# Altium schematic sheet Top.SchDoc
size 437 x 311 mm
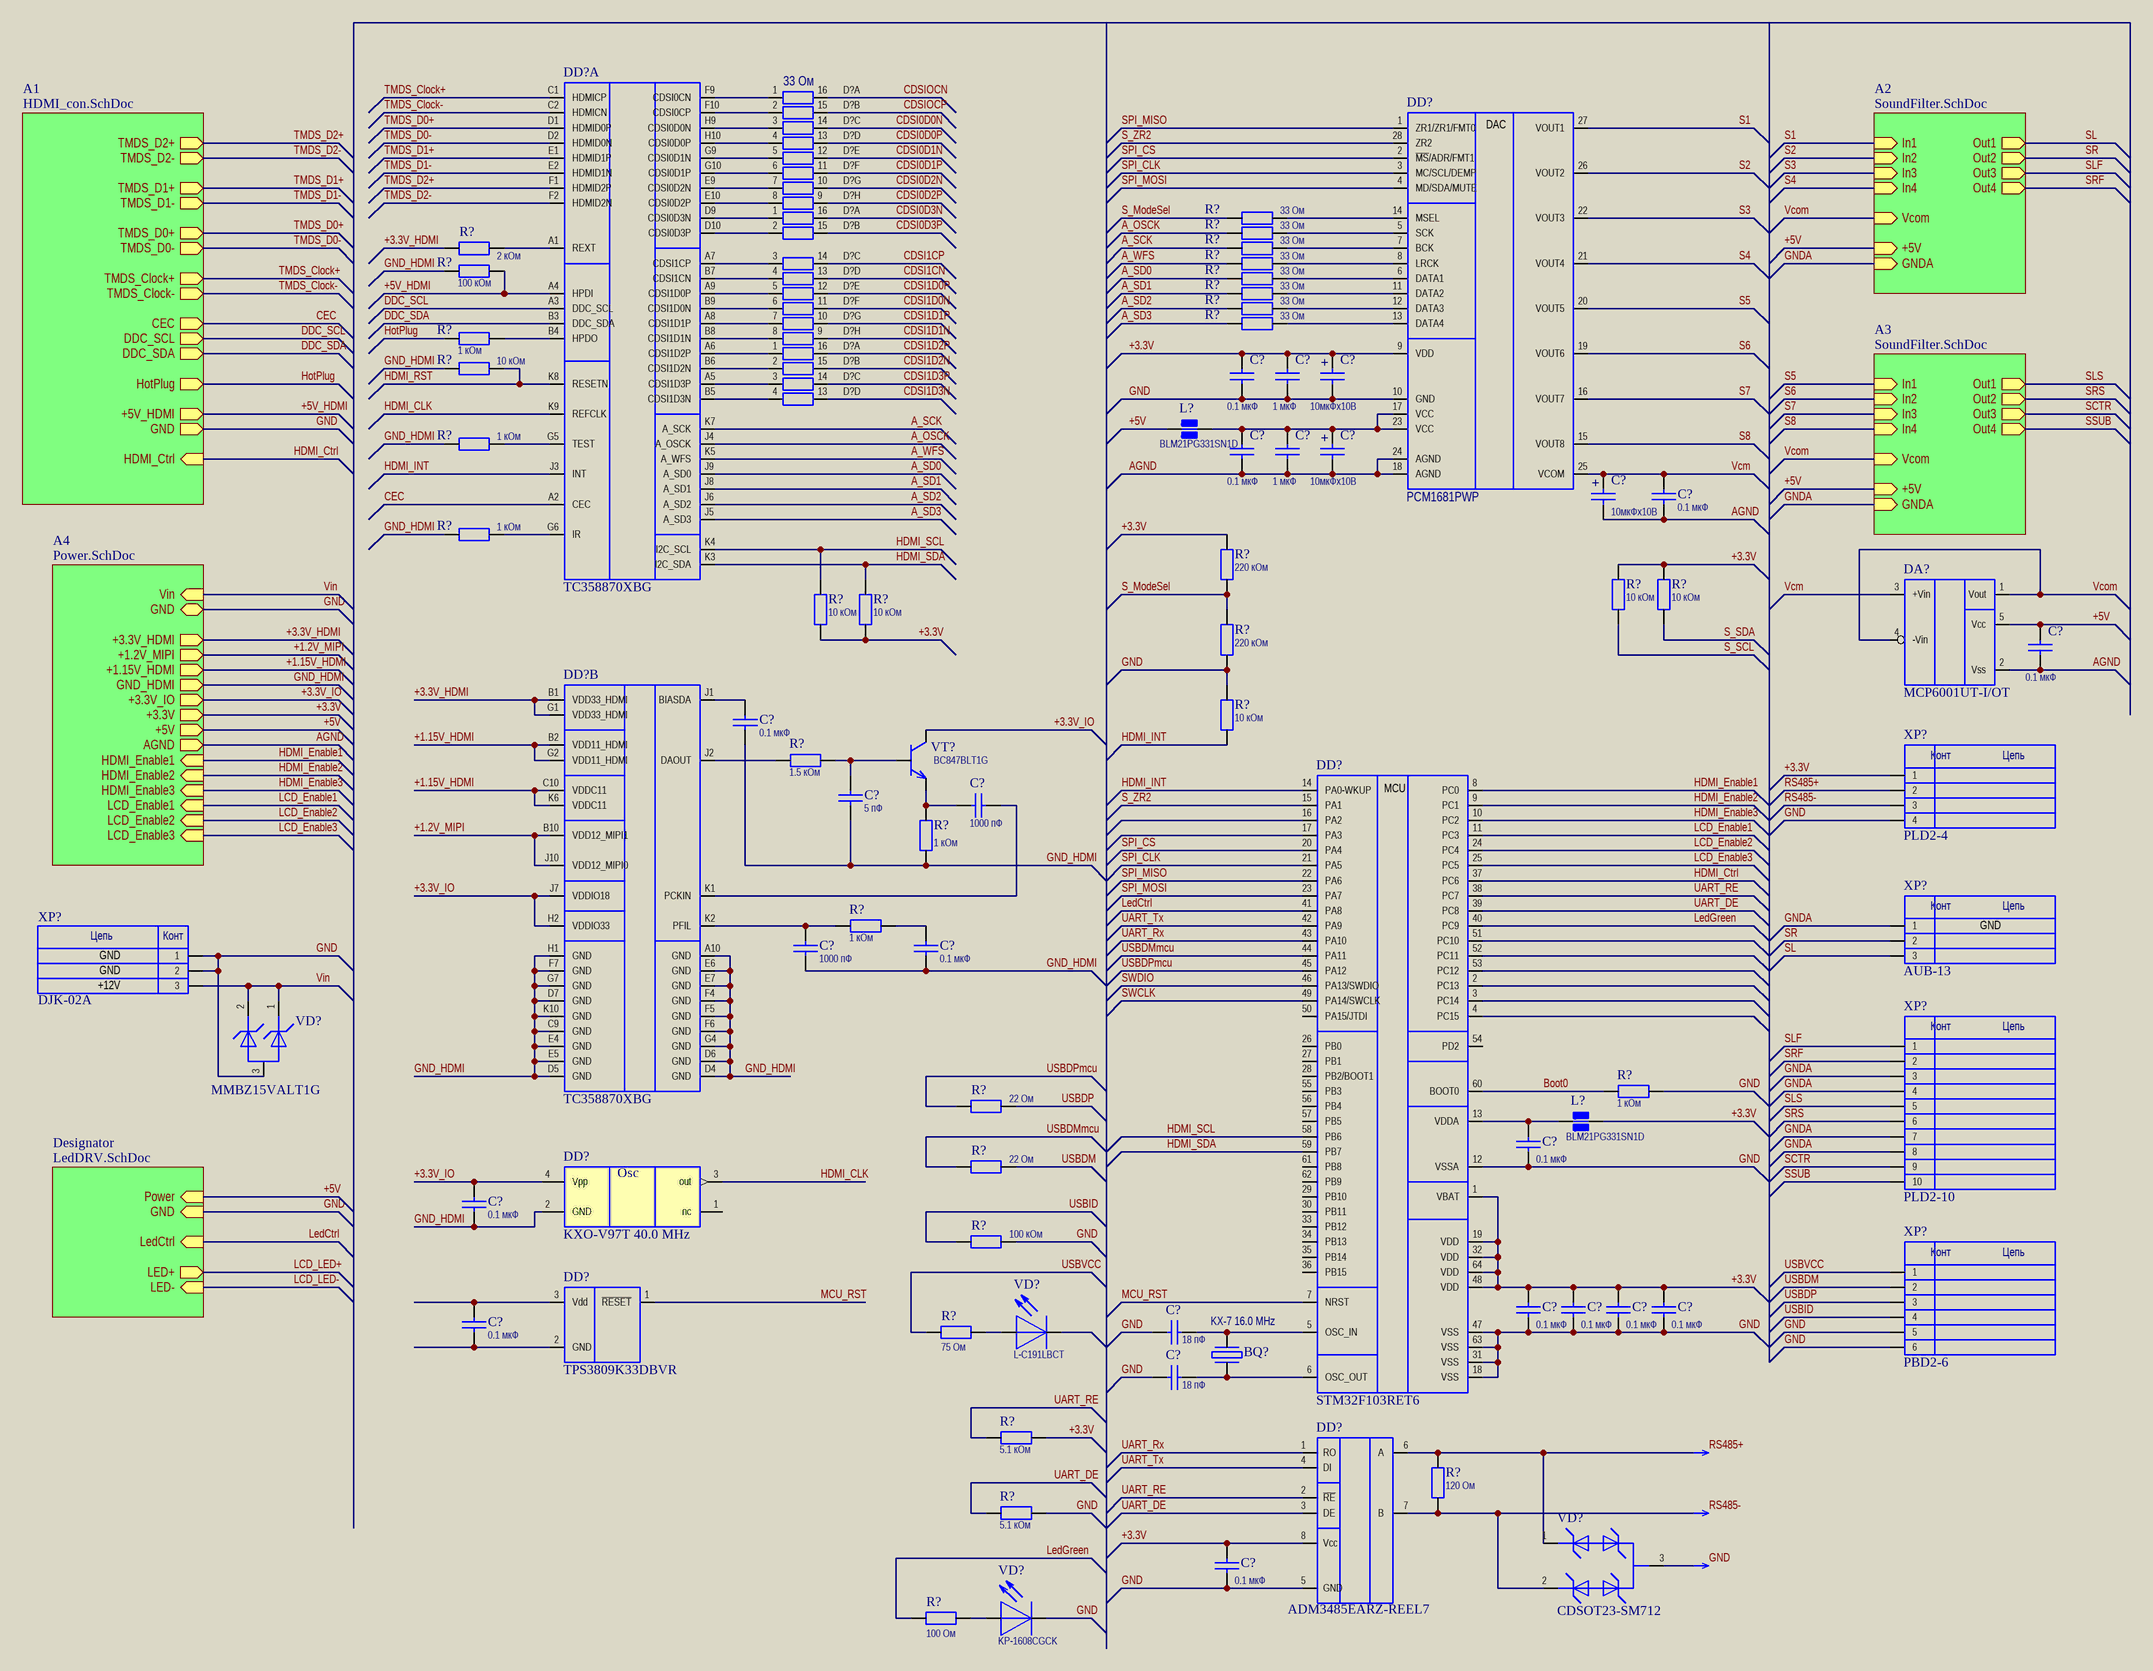
[diagram p0: Top.SchDoc]

## Parts
(Parts that share a designator on the sheet are numbered #1, #2 ... from top to bottom, then left to right.)
BQ?  KX-7 16.0 MHz  [KX-7]
C?#1  value 0.1 мкФ  [Chip0603]  (hidden comment: C)
C?#2  value 1 мкФ  [Chip0603]  (hidden comment: C)
C?#3  value 10мкФx10В  [ChipA]  (hidden comment: CP)
C?#4  value 0.1 мкФ  [Chip0603]  (hidden comment: C)
C?#5  value 1 мкФ  [Chip0603]  (hidden comment: C)
C?#6  value 10мкФx10В  [ChipA]  (hidden comment: CP)
C?#7  value 10мкФx10В  [ChipA]  (hidden comment: CP)
C?#8  value 0.1 мкФ  [Chip0603]  (hidden comment: C)
C?#9  value 0.1 мкФ  [Chip0603]  (hidden comment: C)
C?#10  value 0.1 мкФ  [Chip0603]  (hidden comment: C)
C?#11  value 5 пФ  [Chip0603]  (hidden comment: C)
C?#12  value 1000 пФ  [Chip0603]  (hidden comment: C)
C?#13  value 0.1 мкФ  [Chip0603]  (hidden comment: C)
C?#14  value 1000 пФ  [Chip0603]  (hidden comment: C)
C?#15  value 0.1 мкФ  [Chip0603]  (hidden comment: C)
C?#16  value 0.1 мкФ  [Chip0603]  (hidden comment: C)
C?#17  value 0.1 мкФ  [Chip0603]  (hidden comment: C)
C?#18  value 0.1 мкФ  [Chip0603]  (hidden comment: C)
C?#19  value 0.1 мкФ  [Chip0603]  (hidden comment: C)
C?#20  value 0.1 мкФ  [Chip0603]  (hidden comment: C)
C?#21  value 0.1 мкФ  [Chip0603]  (hidden comment: C)
C?#22  value 18 пФ  [Chip0603]  (hidden comment: C)
C?#23  value 18 пФ  [Chip0603]  (hidden comment: C)
C?#24  value 0.1 мкФ  [Chip0603]  (hidden comment: C)
D?#1  value 33 Ом  [YC248]  (hidden comment: YC248-JR-0733RL)  (part A of 8)
D?#2  YC248-JR-0733RL  [YC248]  (value not drawn)  (part B of 8)
D?#3  YC248-JR-0733RL  [YC248]  (value not drawn)  (part C of 8)
D?#4  YC248-JR-0733RL  [YC248]  (value not drawn)  (part D of 8)
D?#5  YC248-JR-0733RL  [YC248]  (value not drawn)  (part E of 8)
D?#6  YC248-JR-0733RL  [YC248]  (value not drawn)  (part F of 8)
D?#7  YC248-JR-0733RL  [YC248]  (value not drawn)  (part G of 8)
D?#8  YC248-JR-0733RL  [YC248]  (value not drawn)  (part H of 8)
D?#9  YC248-JR-0733RL  [YC248]  (value not drawn)  (part A of 8)
D?#10  YC248-JR-0733RL  [YC248]  (value not drawn)  (part B of 8)
D?#11  YC248-JR-0733RL  [YC248]  (value not drawn)  (part C of 8)
D?#12  YC248-JR-0733RL  [YC248]  (value not drawn)  (part D of 8)
D?#13  YC248-JR-0733RL  [YC248]  (value not drawn)  (part E of 8)
D?#14  YC248-JR-0733RL  [YC248]  (value not drawn)  (part F of 8)
D?#15  YC248-JR-0733RL  [YC248]  (value not drawn)  (part G of 8)
D?#16  YC248-JR-0733RL  [YC248]  (value not drawn)  (part H of 8)
D?#17  YC248-JR-0733RL  [YC248]  (value not drawn)  (part A of 8)
D?#18  YC248-JR-0733RL  [YC248]  (value not drawn)  (part B of 8)
D?#19  YC248-JR-0733RL  [YC248]  (value not drawn)  (part C of 8)
D?#20  YC248-JR-0733RL  [YC248]  (value not drawn)  (part D of 8)
DA?  MCP6001UT-I/OT  [SOT23-5]
DD?#1  PCM1681PWP  [HTSSOP-28]
DD?#2  TC358870XBG  [BGA80C65P10X10_700X700X100]  (part A of 2)
DD?#3  STM32F103RET6  [LQFP64_N]
DD?#4  TC358870XBG  [BGA80C65P10X10_700X700X100]  (part B of 2)
DD?#5  KXO-V97T 40.0 MHz  [KXO-V97T]
DD?#6  TPS3809K33DBVR  [SOT23]
DD?#7  ADM3485EARZ-REEL7  [SO8_s]
L?#1  Name: BLM21PG331SN1D  [Chip0805]  (hidden comment: Bead)
L?#2  Name: BLM21PG331SN1D  [Chip0805]  (hidden comment: Bead)
R?#1  33 Ом  [Res0603]
R?#2  33 Ом  [Res0603]
R?#3  2 кОм  [Res0603]
R?#4  33 Ом  [Res0603]
R?#5  33 Ом  [Res0603]
R?#6  100 кОм  [Res0603]
R?#7  33 Ом  [Res0603]
R?#8  33 Ом  [Res0603]
R?#9  33 Ом  [Res0603]
R?#10  33 Ом  [Res0603]
R?#11  1 кОм  [Res0603]
R?#12  10 кОм  [Res0603]
R?#13  1 кОм  [Res0603]
R?#14  1 кОм  [Res0603]
R?#15  220 кОм  [Res0603]
R?#16  10 кОм  [Res0603]
R?#17  10 кОм  [Res0603]
R?#18  10 кОм  [Res0603]
R?#19  10 кОм  [Res0603]
R?#20  220 кОм  [Res0603]
R?#21  10 кОм  [Res0603]
R?#22  1.5 кОм  [Res0603]
R?#23  1 кОм  [Res0603]
R?#24  1 кОм  [Res0603]
R?#25  1 кОм  [Res0603]
R?#26  22 Ом  [Res0603]
R?#27  22 Ом  [Res0603]
R?#28  100 кОм  [Res0603]
R?#29  75 Ом  [Res0603]
R?#30  5.1 кОм  [Res0603]
R?#31  120 Ом  [Res0603]
R?#32  5.1 кОм  [Res0603]
R?#33  100 Ом  [Res0603]
VD?#1  MMBZ15VALT1G  [SOT23]
VD?#2  L-C191LBCT  [LED_ltst_blue]
VD?#3  CDSOT23-SM712  [SOT23]
VD?#4  KP-1608CGCK  [LED_ltst_green]
VT?  Name: BC847BLT1G  [SOT23]  (hidden comment: NPN)
XP?#1  AUB-13  [AUB-13]
XP?#2  DJK-02A  [DJK-02A]
XP?#3  CON_4  [PLD2-4]  (value not drawn)
XP?#4  PLD2-10  [PLD2-10]
XP?#5  Name: PBD2-6  [USB-MINI]  (hidden comment: CON_6)

## Sub-sheets
A1 = HDMI_con.SchDoc: TMDS_D2+ (out), TMDS_D2- (out), TMDS_D1+ (out), TMDS_D1- (out), TMDS_D0+ (out), TMDS_D0- (out), TMDS_Clock+ (out), TMDS_Clock- (out), CEC (out), DDC_SCL (out), DDC_SDA (out), HotPlug (out), +5V_HDMI (out), GND (out), HDMI_Ctrl (in)
A2 = SoundFilter.SchDoc: In1 (in), In2 (in), In3 (in), In4 (in), Vcom (in), +5V (in), GNDA (in), Out1 (out), Out2 (out), Out3 (out), Out4 (out)
A3 = SoundFilter.SchDoc: In1 (in), In2 (in), In3 (in), In4 (in), Vcom (in), +5V (in), GNDA (in), Out1 (out), Out2 (out), Out3 (out), Out4 (out)
A4 = Power.SchDoc: Vin (in), GND (bidir), +3.3V_HDMI (out), +1.2V_MIPI (out), +1.15V_HDMI (out), GND_HDMI (out), +3.3V_IO (out), +3.3V (out), +5V (out), HDMI_Enable1 (in), HDMI_Enable2 (in), HDMI_Enable3 (in), LCD_Enable1 (in), LCD_Enable2 (in), LCD_Enable3 (in), AGND (out)
Designator = LedDRV.SchDoc: Power (in), GND (in), LedCtrl (in), LED+ (out), LED- (in)

## Nets
GND: BQ?.2 BQ?.4 C?#1.2 C?#2.2 C?#3.2 C?#15.2 C?#17.2 C?#18.2 C?#19.2 C?#20.2 C?#22.1 C?#23.1 C?#24.2 DD?#1.10(GND) DD?#3.12(VSSA) DD?#3.18(VSS) DD?#3.31(VSS) DD?#3.47(VSS) DD?#3.63(VSS) DD?#7.5(GND) R?#20.1 R?#21.1 R?#25.1 R?#28.2 R?#32.1 VD?#1.3 VD?#3.3 VD?#4.2 XP?#2.1 XP?#2.2 XP?#3.4 XP?#5.5 XP?#5.6 ; sheet A1/GND, sheet A4/GND, sheet Designator/GND
+1.2V_MIPI: DD?#4.B10(VDD12_MIPI1) DD?#4.J10(VDD12_MIPI0) ; sheet A4/+1.2V_MIPI
+1.15V_HDMI: DD?#4.B2(VDD11_HDMI) DD?#4.C10(VDDC11) DD?#4.G2(VDD11_HDMI) DD?#4.K6(VDDC11) ; sheet A4/+1.15V_HDMI
+3.3V: C?#1.1 C?#2.1 C?#3.1 C?#17.1 C?#18.1 C?#19.1 C?#20.1 C?#24.1 DD?#1.9(VDD) DD?#3.1(VBAT) DD?#3.19(VDD) DD?#3.32(VDD) DD?#3.48(VDD) DD?#3.64(VDD) DD?#7.8(Vcc) L?#2.2 R?#15.2 R?#16.2 R?#17.2 R?#18.1 R?#19.1 R?#30.2 XP?#3.1 ; sheet A4/+3.3V
+3.3V_HDMI: DD?#4.B1(VDD33_HDMI) DD?#4.G1(VDD33_HDMI) R?#3.2 ; sheet A4/+3.3V_HDMI
+3.3V_IO: C?#16.1 DD?#4.H2(VDDIO33) DD?#4.J7(VDDIO18) DD?#5.4(Vpp) VT?.3 ; sheet A4/+3.3V_IO
+5V: C?#9.1 DA?.5(Vcc) L?#1.1 ; sheet A2/+5V, sheet A3/+5V, sheet A4/+5V, sheet Designator/Power
+5V_HDMI: DD?#2.A4(HPDI) R?#6.1 ; sheet A1/+5V_HDMI
A_OSCK: DD?#2.J4(A_OSCK) R?#2.1
A_SCK: DD?#2.K7(A_SCK) R?#4.1
A_SD0: DD?#2.J9(A_SD0) R?#7.1
A_SD1: DD?#2.J8(A_SD1) R?#8.1
A_SD2: DD?#2.J6(A_SD2) R?#9.1
A_SD3: DD?#2.J5(A_SD3) R?#10.1
A_WFS: DD?#2.K5(A_WFS) R?#5.1
AGND: C?#4.2 C?#5.2 C?#6.2 C?#7.2 C?#8.2 C?#9.2 DA?.2(Vss) DD?#1.18(AGND) DD?#1.24(AGND) ; sheet A4/AGND
Boot0: DD?#3.60(BOOT0) R?#25.2
CDSI0D0N: D?#3.14(B2)
CDSI0D0P: D?#4.13(B3)
CDSI0D1N: D?#5.12(B4)
CDSI0D1P: D?#6.11(B5)
CDSI0D2N: D?#7.10(B6)
CDSI0D2P: D?#8.9(B7)
CDSI0D3N: D?#9.16(B0)
CDSI0D3P: D?#10.15(B1)
CDSI1CN: D?#12.13(B3)
CDSI1CP: D?#11.14(B2)
CDSI1D0N: D?#14.11(B5)
CDSI1D0P: D?#13.12(B4)
CDSI1D1N: D?#16.9(B7)
CDSI1D1P: D?#15.10(B6)
CDSI1D2N: D?#18.15(B1)
CDSI1D2P: D?#17.16(B0)
CDSI1D3N: D?#20.13(B3)
CDSI1D3P: D?#19.14(B2)
CDSIOCN: D?#1.16(B0)
CDSIOCP: D?#2.15(B1)
CEC: DD?#2.A2(CEC) ; sheet A1/CEC
DDC_SCL: DD?#2.A3(DDC_SCL) ; sheet A1/DDC_SCL
DDC_SDA: DD?#2.B3(DDC_SDA) ; sheet A1/DDC_SDA
GND_HDMI: C?#10.2 C?#11.1 C?#13.2 C?#14.1 C?#16.2 DD?#4.A10(GND) DD?#4.C9(GND) DD?#4.D4(GND) DD?#4.D5(GND) DD?#4.D6(GND) DD?#4.D7(GND) DD?#4.E4(GND) DD?#4.E5(GND) DD?#4.E6(GND) DD?#4.E7(GND) DD?#4.F4(GND) DD?#4.F5(GND) DD?#4.F6(GND) DD?#4.F7(GND) DD?#4.G4(GND) DD?#4.G7(GND) DD?#4.H1(GND) DD?#4.K10(GND) DD?#5.2(GND) R?#6.2 R?#12.2 R?#13.2 R?#14.2 R?#23.1 ; sheet A4/GND_HDMI
GNDA: XP?#1.1 XP?#4.3 XP?#4.4 XP?#4.7 XP?#4.8 ; sheet A2/GNDA, sheet A3/GNDA
HDMI_CLK: DD?#2.K9(REFCLK) DD?#5.3(out)
HDMI_Ctrl: DD?#3.37(PC6) ; sheet A1/HDMI_Ctrl
HDMI_Enable1: DD?#3.8(PC0) ; sheet A4/HDMI_Enable1
HDMI_Enable2: DD?#3.9(PC1) ; sheet A4/HDMI_Enable2
HDMI_Enable3: DD?#3.10(PC2) ; sheet A4/HDMI_Enable3
HDMI_INT: DD?#2.J3(INT) DD?#3.14(PA0-WKUP) R?#21.2
HDMI_RST: DD?#2.K8(RESETN) R?#12.1
HDMI_SCL: DD?#2.K4(I2C_SCL) DD?#3.58(PB6) R?#18.2
HDMI_SDA: DD?#2.K3(I2C_SDA) DD?#3.59(PB7) R?#19.2
HotPlug: R?#11.2 ; sheet A1/HotPlug
LCD_Enable1: DD?#3.11(PC3) ; sheet A4/LCD_Enable1
LCD_Enable2: DD?#3.24(PC4) ; sheet A4/LCD_Enable2
LCD_Enable3: DD?#3.25(PC5) ; sheet A4/LCD_Enable3
LCD_LED+: sheet Designator/LED+
LCD_LED-: sheet Designator/LED-
LedCtrl: DD?#3.41(PA8) ; sheet Designator/LedCtrl
LedGreen: DD?#3.40(PC9) R?#33.1
MCU_RST: DD?#3.7(NRST) DD?#6.1(~{RESET})
RS485+: DD?#7.6(A) R?#31.1 VD?#3.1 XP?#3.2
RS485-: DD?#7.7(B) R?#31.2 VD?#3.2 XP?#3.3
S1: DD?#1.27(VOUT1) ; sheet A2/In1
S2: DD?#1.26(VOUT2) ; sheet A2/In2
S3: DD?#1.22(VOUT3) ; sheet A2/In3
S4: DD?#1.21(VOUT4) ; sheet A2/In4
S5: DD?#1.20(VOUT5) ; sheet A3/In1
S6: DD?#1.19(VOUT6) ; sheet A3/In2
S7: DD?#1.16(VOUT7) ; sheet A3/In3
S8: DD?#1.15(VOUT8) ; sheet A3/In4
S_ModeSel: R?#1.1 R?#15.1 R?#20.2
S_SCL: R?#16.1
S_SDA: R?#17.1
S_ZR2: DD?#1.28(ZR2) DD?#3.15(PA1)
SCTR: XP?#4.9 ; sheet A3/Out3
SL: XP?#1.3 ; sheet A2/Out1
SLF: XP?#4.1 ; sheet A2/Out3
SLS: XP?#4.5 ; sheet A3/Out1
SPI_CLK: DD?#1.3(MC/SCL/DEMP) DD?#3.21(PA5)
SPI_CS: DD?#1.2(~{MS}/ADR/FMT1) DD?#3.20(PA4)
SPI_MISO: DD?#1.1(ZR1/ZR1/FMT0) DD?#3.22(PA6)
SPI_MOSI: DD?#1.4(MD/SDA/MUTE) DD?#3.23(PA7)
SR: XP?#1.2 ; sheet A2/Out2
SRF: XP?#4.2 ; sheet A2/Out4
SRS: XP?#4.6 ; sheet A3/Out2
SSUB: XP?#4.10 ; sheet A3/Out4
SWCLK: DD?#3.49(PA14/SWCLK)
SWDIO: DD?#3.46(PA13/SWDIO)
TMDS_Clock+: DD?#2.C1(HDMICP) ; sheet A1/TMDS_Clock+
TMDS_Clock-: DD?#2.C2(HDMICN) ; sheet A1/TMDS_Clock-
TMDS_D0+: DD?#2.D1(HDMID0P) ; sheet A1/TMDS_D0+
TMDS_D0-: DD?#2.D2(HDMID0N) ; sheet A1/TMDS_D0-
TMDS_D1+: DD?#2.E1(HDMID1P) ; sheet A1/TMDS_D1+
TMDS_D1-: DD?#2.E2(HDMID1N) ; sheet A1/TMDS_D1-
TMDS_D2+: DD?#2.F1(HDMID2P) ; sheet A1/TMDS_D2+
TMDS_D2-: DD?#2.F2(HDMID2N) ; sheet A1/TMDS_D2-
UART_DE: DD?#3.39(PC8) DD?#7.3(DE) R?#32.2
UART_RE: DD?#3.38(PC7) DD?#7.2(~{RE}) R?#30.1
UART_Rx: DD?#3.43(PA10) DD?#7.1(RO)
UART_Tx: DD?#3.42(PA9) DD?#7.4(DI)
USBDM: R?#27.2 XP?#5.2
USBDMmcu: DD?#3.44(PA11) R?#27.1
USBDP: R?#26.2 XP?#5.3
USBDPmcu: DD?#3.45(PA12) R?#26.1
USBID: R?#28.1 XP?#5.4
USBVCC: R?#29.1 XP?#5.1
Vcm: C?#7.1 C?#8.1 DA?.3(+Vin) DD?#1.25(VCOM)
Vcom: DA?.1(Vout) DA?.4(-Vin) ; sheet A2/Vcom, sheet A3/Vcom
Vin: VD?#1.1 VD?#1.2 XP?#2.3 ; sheet A4/Vin
NetBQ?_1: BQ?.1 C?#23.2 DD?#3.6(OSC_OUT)
NetBQ?_3: BQ?.3 C?#22.2 DD?#3.5(OSC_IN)
NetC?#4_1: C?#4.1 C?#5.1 C?#6.1 DD?#1.17(VCC) DD?#1.23(VCC) L?#1.2
NetC?#10_1: C?#10.1 DD?#4.J1(BIASDA)
NetC?#11_2: C?#11.2 R?#22.1 VT?.2
NetC?#12_1: C?#12.1 R?#23.2 VT?.1
NetC?#12_2: C?#12.2 DD?#4.K1(PCKIN)
NetC?#13_1: C?#13.1 R?#24.1
NetC?#14_2: C?#14.2 DD?#4.K2(PFIL) R?#24.2
NetC?#15_1: C?#15.1 DD?#3.13(VDDA) L?#2.1
NetC?#21_1: C?#21.1 DD?#6.3(Vdd)
NetC?#21_2: C?#21.2 DD?#6.2(GND)
NetD?#1_1: D?#1.1(A0) DD?#2.F9(CDSI0CN)
NetD?#2_2: D?#2.2(A1) DD?#2.F10(CDSI0CP)
NetD?#3_3: D?#3.3(A2) DD?#2.H9(CDSI0D0N)
NetD?#4_4: D?#4.4(A3) DD?#2.H10(CDSI0D0P)
NetD?#5_5: D?#5.5(A4) DD?#2.G9(CDSI0D1N)
NetD?#6_6: D?#6.6(A5) DD?#2.G10(CDSI0D1P)
NetD?#7_7: D?#7.7(A6) DD?#2.E9(CDSI0D2N)
NetD?#8_8: D?#8.8(A7) DD?#2.E10(CDSI0D2P)
NetD?#9_1: D?#9.1(A0) DD?#2.D9(CDSI0D3N)
NetD?#10_2: D?#10.2(A1) DD?#2.D10(CDSI0D3P)
NetD?#11_3: D?#11.3(A2) DD?#2.A7(CDSI1CP)
NetD?#12_4: D?#12.4(A3) DD?#2.B7(CDSI1CN)
NetD?#13_5: D?#13.5(A4) DD?#2.A9(CDSI1D0P)
NetD?#14_6: D?#14.6(A5) DD?#2.B9(CDSI1D0N)
NetD?#15_7: D?#15.7(A6) DD?#2.A8(CDSI1D1P)
NetD?#16_8: D?#16.8(A7) DD?#2.B8(CDSI1D1N)
NetD?#17_1: D?#17.1(A0) DD?#2.A6(CDSI1D2P)
NetD?#18_2: D?#18.2(A1) DD?#2.B6(CDSI1D2N)
NetD?#19_3: D?#19.3(A2) DD?#2.A5(CDSI1D3P)
NetD?#20_4: D?#20.4(A3) DD?#2.B5(CDSI1D3N)
NetDD?#1_5: DD?#1.5(SCK) R?#2.2
NetDD?#1_6: DD?#1.6(DATA1) R?#7.2
NetDD?#1_7: DD?#1.7(BCK) R?#4.2
NetDD?#1_8: DD?#1.8(LRCK) R?#5.2
NetDD?#1_11: DD?#1.11(DATA2) R?#8.2
NetDD?#1_12: DD?#1.12(DATA3) R?#9.2
NetDD?#1_13: DD?#1.13(DATA4) R?#10.2
NetDD?#1_14: DD?#1.14(MSEL) R?#1.2
NetDD?#2_A1: DD?#2.A1(REXT) R?#3.1
NetDD?#2_B4: DD?#2.B4(HPDO) R?#11.1
NetDD?#2_G5: DD?#2.G5(TEST) R?#13.1
NetDD?#2_G6: DD?#2.G6(IR) R?#14.1
NetDD?#4_J2: DD?#4.J2(DAOUT) R?#22.2
NetR?#29_2: R?#29.2 VD?#2.1
NetR?#33_2: R?#33.2 VD?#4.1

Not connected (* = marked no-connect by the designer): DD?#3 2(PC13) 3(PC14) 4(PC15) 16(PA2) 17(PA3) 26(PB0) 27(PB1) 28(PB2/BOOT1) 29(PB10) 30(PB11) 33(PB12) 34(PB13) 35(PB14) 36(PB15) 50(PA15/JTDI) 51(PC10) 52(PC11) 53(PC12) 54(PD2) 55(PB3) 56(PB4) 57(PB5) 61(PB8) 62(PB9); DD?#5 1(nc); VD?#2 2

## Notes on the sheet
- GND
- +12V
- Перв. примен.
- М. экспертиза
- Справ. №
- Подп. и дата
- Инв. № дубл.
- Взам. инв. №
- Изм.
- Разраб.
- Лист.
- № докум.
- Подп.
- Дата
- Лит.
- Масса
- Масш.
- Инв. № подп.
- Пров.
- Т. контр.
- Н. контр.
- Утв.
- Схема электрическая
- принципиальная
- Лист
- Листов
- Копировал
- Формат А1
- (in symbol CON_3) Цепь; Конт
- (in symbol CON_4) Конт; Цепь
- (in symbol CON_6) Конт; Цепь
- (in symbol CON_10) Конт; Цепь
- (in symbol CP) +
- (in symbol GXO7531) Osc
- (in symbol PCM1681PWPR) DAC
- (in symbol STM32F103RxT6) MCU

## Library data of the parts
BQ? = Crystal: Manufacturer: Any; Class: Resonators; Value: 8 MHz; SubClass: Crystal; Name: KX-7 16.0 MHz; Author: Harry E. Zhurov; FullName: =(Name)
C?#1 C?#2 C?#4 C?#5 C?#8-C?#21 C?#24 = C: Manufacturer: Any; SubClass: General Purpose; Class: Capacitors; Author: Harry E. Zhurov
C?#3 C?#6 C?#7 = CP: Manufacturer: Any; Class: Capacitors; SubClass: Polar; Name: TPSA106K010R0900; Author: Harry E. Zhurov
C?#22 C?#23 = C: Manufacturer: Any; SubClass: General Purpose; Class: Capacitors; Name: CL10C180JB8NNNC; Author: Harry E. Zhurov
D?#1-D?#8 = ResArray8_2: Резисторная сборка; AnnotateMatch: 1; Name: YC248-JR-0733RL
D?#9-D?#16 = ResArray8_2: Резисторная сборка; AnnotateMatch: 2; Name: YC248-JR-0733RL
D?#17-D?#20 = ResArray8_2: Резисторная сборка; AnnotateMatch: 3; Name: YC248-JR-0733RL
DD?#1 = PCM1681PWPR: Name: PCM1681PWP
DD?#2 DD?#4 = TC358870XBG: Interface Bridges (Mobile Peripheral Devices); Name: TC358870XBG
DD?#3 = STM32F103RxT6: Name: STM32F103RET6
DD?#5 = GXO7531: 3.3V CMOS Oscillator; Name: KXO-V97T 40.0 MHz
DD?#6 = TPS3809K33DBVR: 3-Pin Supply Voltage Supervisors; Name: TPS3809K33DBVR
DD?#7 = ADM3485EARZ-REEL7: 3.3 V Slew Rate Limited, Half-Duplex, RS-485/RS-422 Transceivers; Name: ADM3485EARZ-REEL7
L?#1 L?#2 = Bead: Manufacturer: Any; SubClass: General Purpose; Class: Capacitors; Author: Harry E. Zhurov
R?#1-R?#33 = R: Manufacturer: Any; Class: Resistor; SubClass: Constant
  R?#1 R?#2 R?#4 R?#5 R?#7-R?#10: Value: 33 Ом
  R?#3: Value: 2 кОм
  R?#6 R?#28: Value: 100 кОм
  R?#11 R?#13 R?#14 R?#23-R?#25: Value: 1 кОм
  R?#12 R?#16-R?#19 R?#21: Value: 10 кОм
  R?#15 R?#20: Value: 220 кОм
  R?#22: Value: 1.5 кОм
  R?#26 R?#27: Value: 22 Ом
  R?#29: Value: 75 Ом
  R?#30 R?#32: Value: 5.1 кОм
  R?#31: Value: 120 Ом
  R?#33: Value: 100 Ом
VD?#1 = Dual supressor: Name: MMBZ15VALT1G
VD?#2 VD?#4 = LD: Manufacturer: Any; Class: LED; Author: Harry E. Zhurov
  VD?#2: Name: L-C191LBCT
  VD?#4: Name: KP-1608CGCK
VD?#3 = CDSOT23-SM712: Surface Mount TVS Diode; Name: CDSOT23-SM712
VT? = NPN: Manufacturer: Any; Class: Transistors; SubClass: NPN; Author: Harry E. Zhurov; FullName: =(Name)
XP?#1 XP?#2 = CON_3
  XP?#1: Name: AUB-13
  XP?#2: Name: DJK-02A
XP?#4 = CON_10: Name: PLD2-10
DA? = MCP6001UT-I/OT: Name: MCP6001UT-I/OT
XP?#3 = CON_4: Name: PLD2-4